# EAGLE design Slave (EAGLE 7.5.0)
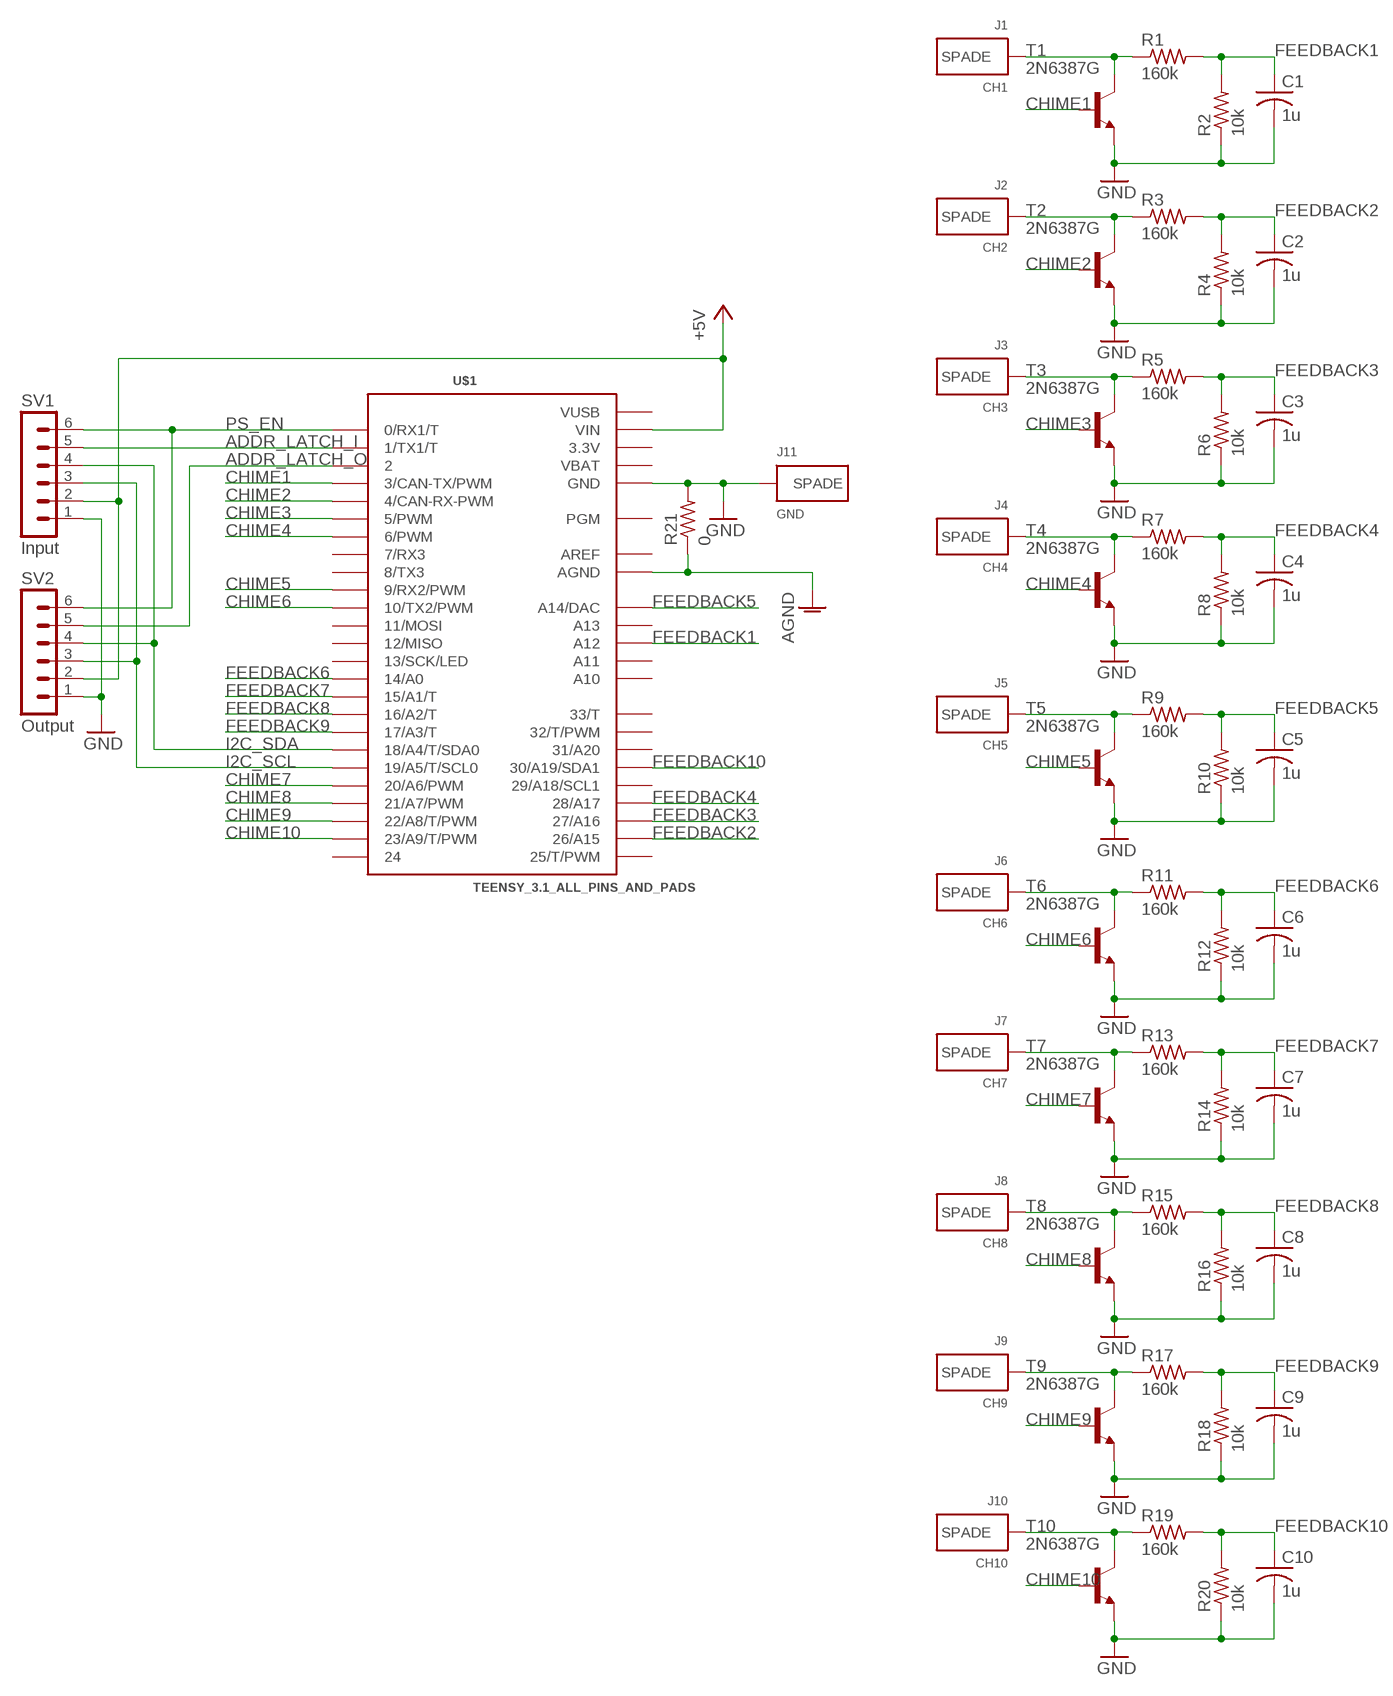
[diagram p0: schematic, sheet 1]

## Parts
C1  1u  C-USC0805  [C0805]
C2  1u  C-USC0805  [C0805]
C3  1u  C-USC0805  [C0805]
C4  1u  C-USC0805  [C0805]
C5  1u  C-USC0805  [C0805]
C6  1u  C-USC0805  [C0805]
C7  1u  C-USC0805  [C0805]
C8  1u  C-USC0805  [C0805]
C9  1u  C-USC0805  [C0805]
C10  1u  C-USC0805  [C0805]
J1  CH1  19705-4001  [19705-4001]
J2  CH2  19705-4001  [19705-4001]
J3  CH3  19705-4001  [19705-4001]
J4  CH4  19705-4001  [19705-4001]
J5  CH5  19705-4001  [19705-4001]
J6  CH6  19705-4001  [19705-4001]
J7  CH7  19705-4001  [19705-4001]
J8  CH8  19705-4001  [19705-4001]
J9  CH9  19705-4001  [19705-4001]
J10  CH10  19705-4001  [19705-4001]
J11  GND  19705-4001  [19705-4001]
R1  160k  R-US_R0805  [R0805]
R2  10k  R-US_R0805  [R0805]
R3  160k  R-US_R0805  [R0805]
R4  10k  R-US_R0805  [R0805]
R5  160k  R-US_R0805  [R0805]
R6  10k  R-US_R0805  [R0805]
R7  160k  R-US_R0805  [R0805]
R8  10k  R-US_R0805  [R0805]
R9  160k  R-US_R0805  [R0805]
R10  10k  R-US_R0805  [R0805]
R11  160k  R-US_R0805  [R0805]
R12  10k  R-US_R0805  [R0805]
R13  160k  R-US_R0805  [R0805]
R14  10k  R-US_R0805  [R0805]
R15  160k  R-US_R0805  [R0805]
R16  10k  R-US_R0805  [R0805]
R17  160k  R-US_R0805  [R0805]
R18  10k  R-US_R0805  [R0805]
R19  160k  R-US_R0805  [R0805]
R20  10k  R-US_R0805  [R0805]
R21  0  R-US_R0805  [R0805]
SV1  Input  MA06-1  [MA06-1]
SV2  Output  MA06-1  [MA06-1]
T1  2N6387G  -NPN-TO220V  [TO220V]
T2  2N6387G  -NPN-TO220V  [TO220V]
T3  2N6387G  -NPN-TO220V  [TO220V]
T4  2N6387G  -NPN-TO220V  [TO220V]
T5  2N6387G  -NPN-TO220V  [TO220V]
T6  2N6387G  -NPN-TO220V  [TO220V]
T7  2N6387G  -NPN-TO220V  [TO220V]
T8  2N6387G  -NPN-TO220V  [TO220V]
T9  2N6387G  -NPN-TO220V  [TO220V]
T10  2N6387G  -NPN-TO220V  [TO220V]
U$1  TEENSY_3.1_ALL_PINS_AND_PADS  [TEENSY3_ALL_PINS_&_PADS]

## Nets
+5V: SV1.2 SV2.2 U$1.VIN
ADDR_LATCH_I: SV1.5 U$1.1(1/TX1/T)
ADDR_LATCH_O: SV2.5 U$1.2
AGND: R21.1 U$1.AGND
CHIME1: T1.1(B) U$1.3(3/CAN-TX/PWM)
CHIME2: T2.1(B) U$1.4(4/CAN-RX-PWM)
CHIME3: T3.1(B) U$1.5(5/PWM)
CHIME4: T4.1(B) U$1.6(6/PWM)
CHIME5: T5.1(B) U$1.9(9/RX2/PWM)
CHIME6: T6.1(B) U$1.10(10/TX2/PWM)
CHIME7: T7.1(B) U$1.20/A6(20/A6/PWM)
CHIME8: T8.1(B) U$1.21/A7(21/A7/PWM)
CHIME9: T9.1(B) U$1.22/A8(22/A8/T/PWM)
CHIME10: T10.1(B) U$1.23/A9(23/A9/T/PWM)
FEEDBACK1: C1.1 R1.2 R2.2 U$1.A12
FEEDBACK2: C2.1 R3.2 R4.2 U$1.26(26/A15)
FEEDBACK3: C3.1 R5.2 R6.2 U$1.27(27/A16)
FEEDBACK4: C4.1 R7.2 R8.2 U$1.28(28/A17)
FEEDBACK5: C5.1 R9.2 R10.2 U$1.RESET/DAC(A14/DAC)
FEEDBACK6: C6.1 R11.2 R12.2 U$1.14/A0
FEEDBACK7: C7.1 R13.2 R14.2 U$1.15/A1(15/A1/T)
FEEDBACK8: C8.1 R15.2 R16.2 U$1.16/A2(16/A2/T)
FEEDBACK9: C9.1 R17.2 R18.2 U$1.17/A3(17/A3/T)
FEEDBACK10: C10.1 R19.2 R20.2 U$1.30(30/A19/SDA1)
GND: C1.2 C2.2 C3.2 C4.2 C5.2 C6.2 C7.2 C8.2 C9.2 C10.2 J11.P$1(SPADE) J11.P$2(SPADE) R2.1 R4.1 R6.1 R8.1 R10.1 R12.1 R14.1 R16.1 R18.1 R20.1 R21.2 SV1.1 SV2.1 T1.3(E) T2.3(E) T3.3(E) T4.3(E) T5.3(E) T6.3(E) T7.3(E) T8.3(E) T9.3(E) T10.3(E) U$1.GND U$1.GND1(GND) U$1.GND2(GND)
HS1: J1.P$1(SPADE) J1.P$2(SPADE) R1.1 T1.2(C)
HS2: J2.P$1(SPADE) J2.P$2(SPADE) R3.1 T2.2(C)
HS3: J3.P$1(SPADE) J3.P$2(SPADE) R5.1 T3.2(C)
HS4: J4.P$1(SPADE) J4.P$2(SPADE) R7.1 T4.2(C)
HS5: J5.P$1(SPADE) J5.P$2(SPADE) R9.1 T5.2(C)
HS6: J6.P$1(SPADE) J6.P$2(SPADE) R11.1 T6.2(C)
HS7: J7.P$1(SPADE) J7.P$2(SPADE) R13.1 T7.2(C)
HS8: J8.P$1(SPADE) J8.P$2(SPADE) R15.1 T8.2(C)
HS9: J9.P$1(SPADE) J9.P$2(SPADE) R17.1 T9.2(C)
HS10: J10.P$1(SPADE) J10.P$2(SPADE) R19.1 T10.2(C)
I2C_SCL: SV1.3 SV2.3 U$1.19/A5(19/A5/T/SCL0)
I2C_SDA: SV1.4 SV2.4 U$1.18/A4(18/A4/T/SDA0)
PS_EN: SV1.6 SV2.6 U$1.0(0/RX1/T)
Unconnected: U$1.7(7/RX3) U$1.8(8/TX3) U$1.11(11/MOSI) U$1.12(12/MISO) U$1.13(13/SCK/LED) U$1.24 U$1.25(25/T/PWM) U$1.29(29/A18/SCL1) U$1.31(31/A20) U$1.32(32/T/PWM) U$1.33(33/T) U$1.A10 U$1.A11 U$1.A13 U$1.PGM

## Power pins joined to a net without a drawn wire
3.3V: U$1.3.3V U$1.3.3V1(3.3V) U$1.3.3V2(3.3V)
AREF: U$1.AREF
VBAT: U$1.VBAT
VUSB: U$1.VUSB

## Library data of the parts
C1-C10 = resistor:C-US: CAPACITOR, American symbol
J1-J11 = DAVe3283:19705-4001: Molex 19705-4001 Spade Connector
R1-R21 = resistor:R-US_: RESISTOR, American symbol
SV1 SV2 = con-lstb:MA06-1: PIN HEADER; OC_FARNELL: unknown; OC_NEWARK: unknown
T1-T10 = transistor-neu-to92:*-NPN-: NPN Transistror
U$1 = Teensy_3_and_LC_Series_Boards_v1.1:TEENSY_3.1_ALL_PINS_AND_PADS: Footprint for Teensy 3.1 or 3.2 board using all pads and all through-holes. Pads need a 2x7 0.1" SMD header.

## Board
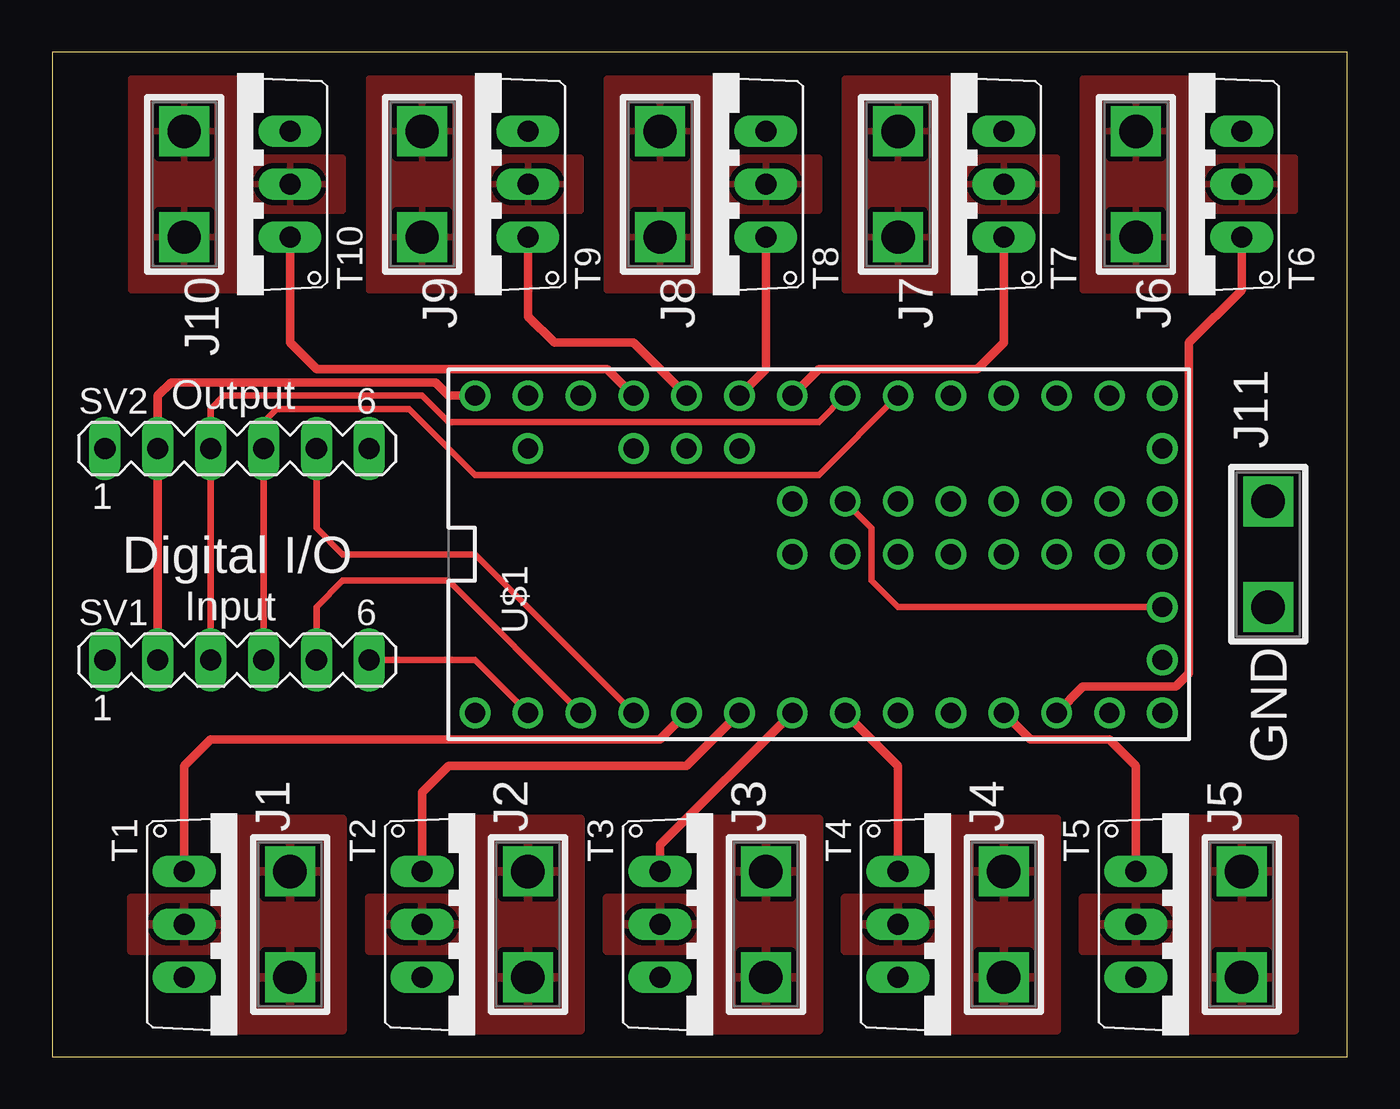
[diagram p1: board, top side]
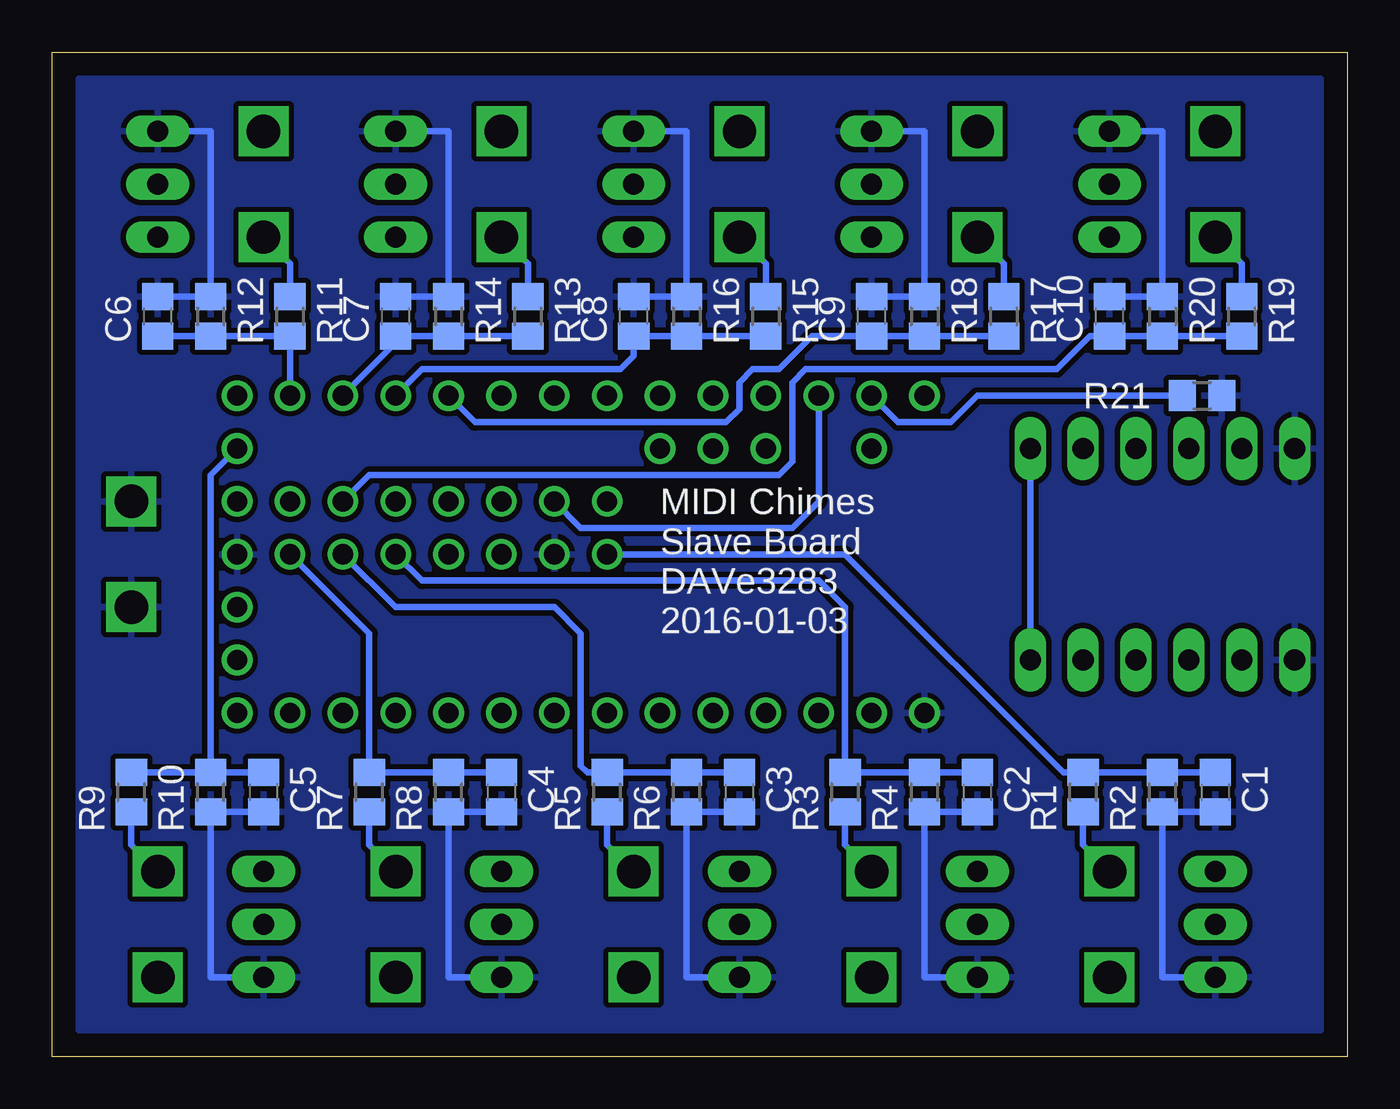
[diagram p2: board, bottom side, seen from below]

Size 62.23 x 48.26 mm. Coordinates in mm from the lower left corner, seen from the top.
Outline: 0,0 62.23,0 62.23,48.26 0,48.26 0,0
Copper layers (1*16): Top 0.035mm / dielectric 1.5mm / Bottom 0.035mm
Design rules "default *": minimum track width 10mil, minimum drill 12mil, track to track 8mil, track to pad 8mil, pad to pad 8mil, via to via 8mil, smd to smd 8mil, copper to edge 40mil, drill to drill 8mil, minimum pad ring 10mil, minimum via ring 8mil, stop-mask expansion 4mil, vias tented up to drill 0mil, thermal gap 10mil

### Footprints (pad centres in the part's own frame; a part is rotated, then mirrored left to right if it is on the bottom)
C0805 = smd 1.3 x 1.5: 1 -0.95,0; 2 0.95,0
19705-4001 = drill 1.6 square: P$1 -2.54,0; P$2 2.54,0
R0805 = smd 1.3 x 1.5: 1 -0.95,0; 2 0.95,0
MA06-1 = drill 1.016 long: 1 -6.35,0; 2 -3.81,0; 3 -1.27,0; 4 1.27,0; 5 3.81,0; 6 6.35,0
TO220V = drill 1.016 long: 1 -2.54,-2.54; 2 0,-2.54; 3 2.54,-2.54
TEENSY3_ALL_PINS_&_PADS = drill 0.965: 0 -7.62,13.97; 1 -7.62,11.43; 2 -7.62,8.89; 3 -7.62,6.35; 3.3V 7.62,11.43; 3.3V1 -2.54,-16.51; 3.3V2 2.54,-1.27; 4 -7.62,3.81; 5 -7.62,1.27; 6 -7.62,-1.27; 7 -7.62,-3.81; 8 -7.62,-6.35; 9 -7.62,-8.89; 10 -7.62,-11.43; 11 -7.62,-13.97; 12 -7.62,-16.51; 13 7.62,-16.51; 14/A0 7.62,-13.97; 15/A1 7.62,-11.43; 16/A2 7.62,-8.89; 17/A3 7.62,-6.35; 18/A4 7.62,-3.81; 19/A5 7.62,-1.27; 20/A6 7.62,1.27; 21/A7 7.62,3.81; 22/A8 7.62,6.35; 23/A9 7.62,8.89; 24 0,-3.81; 25 0,-6.35; 26 0,-8.89; 27 0,-11.43; 28 0,-13.97; 29 2.54,-13.97; 30 2.54,-11.43; 31 2.54,-8.89; 32 2.54,-6.35; 33 2.54,-3.81; A10 5.08,6.35; A11 5.08,3.81; A12 0,1.27; A13 2.54,1.27; AGND 7.62,13.97; AREF 5.08,8.89; GND -7.62,16.51; GND1 0,-16.51; GND2 0,-1.27; PGM 2.54,-16.51; RESET/DAC 5.08,-16.51; VBAT -5.08,-16.51; VIN 7.62,16.51; VUSB 5.08,13.97

### Placement (x,y rotation side)
C1  6.35,12.7 270 bottom
C2  17.78,12.7 270 bottom
C3  29.21,12.7 270 bottom
C4  40.64,12.7 270 bottom
C5  52.07,12.7 270 bottom
C6  57.15,35.56 90 bottom
C7  45.72,35.56 90 bottom
C8  34.29,35.56 90 bottom
C9  22.86,35.56 90 bottom
C10  11.43,35.56 90 bottom
J1  11.43,6.35 90 top
J2  22.86,6.35 90 top
J3  34.29,6.35 90 top
J4  45.72,6.35 90 top
J5  57.15,6.35 90 top
J6  52.07,41.91 270 top
J7  40.64,41.91 270 top
J8  29.21,41.91 270 top
J9  17.78,41.91 270 top
J10  6.35,41.91 270 top
J11  58.42,24.13 90 top
R1  12.7,12.7 90 bottom
R2  8.89,12.7 90 bottom
R3  24.13,12.7 90 bottom
R4  20.32,12.7 90 bottom
R5  35.56,12.7 90 bottom
R6  31.75,12.7 90 bottom
R7  46.99,12.7 90 bottom
R8  43.18,12.7 90 bottom
R9  58.42,12.7 90 bottom
R10  54.61,12.7 90 bottom
R11  50.8,35.56 270 bottom
R12  54.61,35.56 270 bottom
R13  39.37,35.56 270 bottom
R14  43.18,35.56 270 bottom
R15  27.94,35.56 270 bottom
R16  31.75,35.56 270 bottom
R17  16.51,35.56 270 bottom
R18  20.32,35.56 270 bottom
R19  5.08,35.56 270 bottom
R20  8.89,35.56 270 bottom
R21  6.99,31.75 0 bottom
SV1  8.89,19.05 0 top
SV2  8.89,29.21 0 top
T1  8.89,6.35 270 top
T2  20.32,6.35 270 top
T3  31.75,6.35 270 top
T4  43.18,6.35 270 top
T5  54.61,6.35 270 top
T6  54.61,41.91 90 top
T7  43.18,41.91 90 top
T8  31.75,41.91 90 top
T9  20.32,41.91 90 top
T10  8.89,41.91 90 top
U$1  36.83,24.13 90 top

### Tracks (layer width: path | path; a pad name or v marks a point on that pad's centre or on a via)
3.3V
  Top 0.305: U$1.3.3V2 39.37,25.4 39.37,22.86 40.64,21.59 U$1.3.3V1
  Bottom 0.305: U$1.3.3V 25.4,26.67 26.67,25.4 36.83,25.4 U$1.3.3V2
+5V
  Top 0.406: SV1.2 SV2.2 5.08,31.75 5.71,32.38 18.41,32.38 19.05,31.75 U$1.VIN
ADDR_LATCH_I
  Top 0.305: SV1.5 12.7,21.59 13.97,22.86 19.05,22.86 U$1.1
ADDR_LATCH_O
  Top 0.305: U$1.2 20.32,24.13 13.97,24.13 12.7,25.4 SV2.5
AGND
  Bottom 0.305: U$1.AGND 21.59,30.48 19.05,30.48 17.78,31.75 R21.1
CHIME1
  Top 0.406: U$1.3 29.21,15.24 7.62,15.24 6.35,13.97 T1.1
CHIME2
  Top 0.406: T2.1 17.78,12.7 19.05,13.97 30.48,13.97 U$1.4
CHIME3
  Top 0.406: U$1.5 29.21,10.16 T3.1
CHIME4
  Top 0.406: T4.1 40.64,13.97 U$1.6
CHIME5
  Top 0.406: T5.1 52.07,13.97 50.8,15.24 46.99,15.24 U$1.9
CHIME6
  Top 0.406: T6.1 57.15,36.83 54.61,34.29 54.61,18.41 53.98,17.78 49.53,17.78 U$1.10
CHIME7
  Top 0.406: T7.1 45.72,34.29 44.45,33.02 36.83,33.02 U$1.20/A6
CHIME8
  Top 0.406: T8.1 34.29,33.02 U$1.21/A7
CHIME9
  Top 0.406: T9.1 22.86,35.56 24.13,34.29 27.94,34.29 U$1.22/A8
CHIME10
  Top 0.406: T10.1 11.43,34.29 12.7,33.02 26.67,33.02 U$1.23/A9
FEEDBACK1
  Bottom 0.305: C1.1 R2.2 R1.2 13.65,13.65 24.13,24.13 U$1.A12
FEEDBACK2
  Bottom 0.305: C2.1 R4.2 R3.2 24.13,21.59 25.4,22.86 44.45,22.86 U$1.26
FEEDBACK3
  Bottom 0.305: C3.1 R6.2 | R6.2 31.75,13.97 | R6.2 R5.2 36.51,13.65 36.83,13.97 36.83,20.32 38.1,21.59 45.72,21.59 U$1.27
FEEDBACK4
  Bottom 0.305: C4.1 R8.2 R7.2 46.99,20.32 U$1.28
FEEDBACK5
  Bottom 0.305: R9.2 R10.2 | R10.2 C5.1 | R10.2 54.61,27.94 U$1.RESET/DAC
FEEDBACK6
  Bottom 0.305: C6.1 R12.2 R11.2 U$1.14/A0
FEEDBACK7
  Bottom 0.305: R13.2 R14.2 C7.1 45.72,34.29 U$1.15/A1
FEEDBACK8
  Bottom 0.305: R15.2 R16.2 C8.1 34.29,33.66 34.92,33.02 44.45,33.02 U$1.16/A2
FEEDBACK9
  Bottom 0.305: R17.2 R18.2 C9.1 25.71,34.61 27.3,33.02 28.57,33.02 29.21,32.38 29.21,31.11 29.84,30.48 41.91,30.48 U$1.17/A3
FEEDBACK10
  Bottom 0.305: R19.2 R20.2 C10.1 12.38,34.61 13.97,33.02 26.04,33.02 26.67,32.38 26.67,28.57 27.3,27.94 46.99,27.94 U$1.30
GND
  Bottom 0.305: C1.2 R2.1 8.89,3.81 T1.3 | C2.2 R4.1 20.32,3.81 T2.3 | T3.3 31.75,3.81 R6.1 C3.2 | T4.3 43.18,3.81 R8.1 C4.2 | T5.3 54.61,3.81 R10.1 C5.2 | T10.3 8.89,44.45 R20.1 C10.2 | T9.3 20.32,44.45 R18.1 C9.2 | T8.3 31.75,44.45 R16.1 C8.2 | T7.3 43.18,44.45 R14.1 C7.2 | T6.3 54.61,44.45 R12.1 C6.2
  pour Bottom (isolate 0.254): 1.27,46.99 60.96,46.99 60.96,1.27 1.27,1.27
HS1
  Bottom 0.305: R1.1 12.7,10.16 J1.P$2
  pour Top: 3.81,7.62 8.89,7.62 8.89,11.43 13.97,11.43 13.97,1.27 8.89,1.27 8.89,5.08 3.81,5.08
HS2
  Bottom 0.305: R3.1 24.13,10.16 J2.P$2
  pour Top: 15.24,7.62 15.24,5.08 20.32,5.08 20.32,1.27 25.4,1.27 25.4,11.43 20.32,11.43 20.32,7.62
HS3
  Bottom 0.305: R5.1 35.56,10.16 J3.P$2
  pour Top: 26.67,7.62 31.75,7.62 31.75,11.43 36.83,11.43 36.83,1.27 31.75,1.27 31.75,5.08 26.67,5.08
HS4
  Bottom 0.305: R7.1 46.99,10.16 J4.P$2
  pour Top: 38.1,7.62 43.18,7.62 43.18,11.43 48.26,11.43 48.26,1.27 43.18,1.27 43.18,5.08 38.1,5.08
HS5
  Bottom 0.305: R9.1 58.42,10.16 J5.P$2
  pour Top: 49.53,7.62 54.61,7.62 54.61,11.43 59.69,11.43 59.69,1.27 54.61,1.27 54.61,5.08 49.53,5.08
HS6
  Bottom 0.305: R11.1 50.8,38.1 J6.P$2
  pour Top: 49.53,46.99 54.61,46.99 54.61,43.18 59.69,43.18 59.69,40.64 54.61,40.64 54.61,36.83 49.53,36.83
HS7
  Bottom 0.305: R13.1 39.37,38.1 J7.P$2
  pour Top: 38.1,46.99 43.18,46.99 43.18,43.18 48.26,43.18 48.26,40.64 43.18,40.64 43.18,36.83 38.1,36.83
HS8
  Bottom 0.305: R15.1 27.94,38.1 J8.P$2
  pour Top: 26.67,46.99 31.75,46.99 31.75,43.18 36.83,43.18 36.83,40.64 31.75,40.64 31.75,36.83 26.67,36.83
HS9
  Bottom 0.305: R17.1 16.51,38.1 J9.P$2
  pour Top: 15.24,46.99 20.32,46.99 20.32,43.18 25.4,43.18 25.4,40.64 20.32,40.64 20.32,36.83 15.24,36.83
HS10
  Bottom 0.305: R19.1 5.08,38.1 J10.P$2
  pour Top: 13.97,43.18 13.97,40.64 8.89,40.64 8.89,36.83 3.81,36.83 3.81,46.99 8.89,46.99 8.89,43.18
I2C_SCL
  Top 0.305: SV1.3 SV2.3 7.62,31.11 8.26,31.75 17.78,31.75 19.05,30.48 36.83,30.48 U$1.19/A5
I2C_SDA
  Top 0.305: SV1.4 SV2.4 10.16,30.48 10.79,31.11 17.14,31.11 20.32,27.94 36.83,27.94 U$1.18/A4
PS_EN
  Top 0.305: SV1.6 20.32,19.05 U$1.0
  Bottom 0.305: SV1.6 SV2.6

### Text on the board
tNames: Output | Digital I/O | Input | GND
bNames: MIDI Chimes / Slave Board / DAVe3283 / 2016-01-03